# Altium schematic sheet 3_3V Regulator.SchDoc
size A
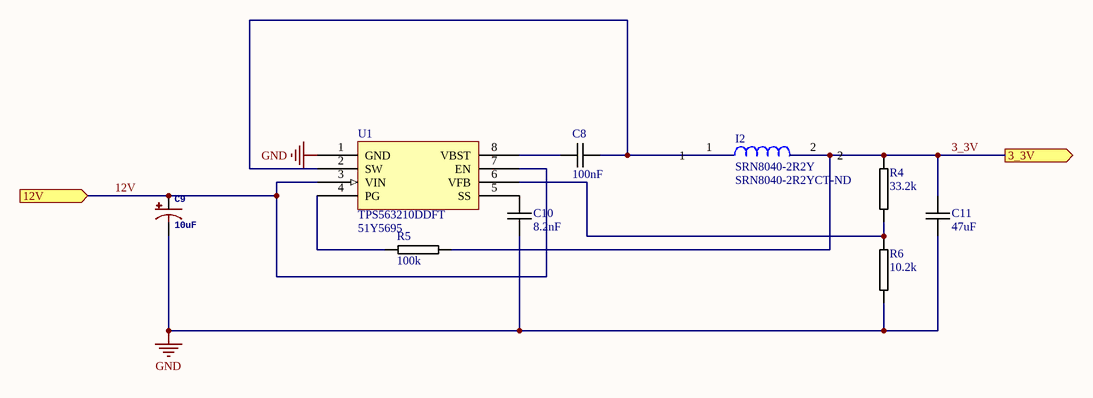
[diagram p0: 3_3V Regulator.SchDoc]

## Parts
C8  100nF  [0805C-TBD]
C9  10uF  [EIA3216]
C10  8.2nF  [0603C-GENERIC]
C11  47uF  [0805C-TBD]
I2  SRN8040-2R2Y  Supplier Part Number 1: SRN8040-2R2YCT-ND  [SRN8040]
R4  33.2k  [0402R-TBD]
R5  100k  [0402R-TBD]
R6  10.2k  [0402R-TBD]
U1  TPS563210DDFT  Supplier Part Number 1: 51Y5695  [SOT23-8]

## Ports
3_3V (out), 12V (in)

## Nets
GND: C9.C(-) C10.2 C11.1 R6.2 U1.1(GND)
3_3V: C11.2 I2.2 R4.1 R5.2 ; port 3_3V
12V: C9.A(+) U1.3(VIN) U1.7(EN) ; port 12V
NetC8_1: C8.1 U1.8(VBST)
NetC8_2: C8.2 I2.1 U1.2(SW)
NetC10_1: C10.1 U1.5(SS)
NetR4_2: R4.2 R6.1 U1.6(VFB)
NetR5_1: R5.1 U1.4(PG)

## Library data of the parts
C8 C11 = 0603C-2U2-6V3-X5R-PAN: CAPACITOR 0805 CERAMIC; Manufacturer Part Number: ECJ-1VB0J225K; Manufacturer: Panasonic - ECG; Supplier 1: Digi-Key; Supplier Part Number 1: PCC2273TR-ND; Reel: *
C9 = 10UF-TANT: PROD_ID: CAP-00811
C10 = 0603C-000: CAPACITOR 0603 CERAMIC
I2 = SRN8040-2R2Y: FIXED IND 2.2UH 6.3A 13 MOHM SMD; Manufacturer: Bourns Inc.; Material - Core: Ferrite; Tolerance: ±30%; Shielding: Semi-Shielded; DC Resistance (DCR): 13 mOhm Max; Q @ Freq: 13 @ 7.96MHz; Supplier 1: Digi-Key; Manufacturer Part Number: SRN8040-2R2Y; RoHS: RoHS Compliant; Category: Inductors, Coils, Chokes; Stock 1: 10441; Pricing 1: 1=0.63, 10=0.547, 100=0.391, 500=0.32844 (USD); Packaging: Cut Tape (CT); Part Status: Active; Type: Wirewound; Ratings: -; Operating Temperature: -40°C ~ 125°C; Mounting Type: Surface Mount; Package / Case: Nonstandard; Supplier Device Package: -; Size / Dimension: 0.315" L x 0.315" W (8.00mm x 8.00mm); Height - Seated (Max): 0.157" (4.00mm); ComponentLink1URL: http://www.bourns.com/docs/Product-Datasheets/SRN8040.pdf; ComponentLink1Description: http://www.bourns.com/docs/Product-Datasheets/SRN8040.pdf
R4-R6 = 0402R-TBD: RESISTOR 0402 VALUE TO BE DETERMINED
U1 = TPS563210DDFT: TEXAS INSTRUMENTS - TPS563210DDFT - DC/DC CONV, SYNC BUCK, 650KHZ, SOT-23-8; Topology: Synchronous Buck (Step Down); Input Voltage Min: 4.5; Input Voltage Max: 17; No. of Outputs: 1; DC / DC Converter IC Case: SOT-23; No. of Pins: 8; Output Current: 3; Supplier 1: Newark; Manufacturer: TEXAS INSTRUMENTS; Manufacturer Part Number: TPS563210DDFT; RoHS: YES; Stock 1: 60; Pricing 1: 1=1.92, 10=1.63, 25=1.52, 50=1.41, 100=1.3 (USD); ComponentLink1URL: http://www.ti.com/general/docs/lit/getliterature.tsp?genericPartNumber=TPS563210&amp;&amp;fileType=pdf; ComponentLink1Description: http://www.ti.com/general/docs/lit/getliterature.tsp?genericPartNumber=TPS563210&amp;&amp;fileType=pdf